# EAGLE design Gripper Control Board (EAGLE 9.5.2)
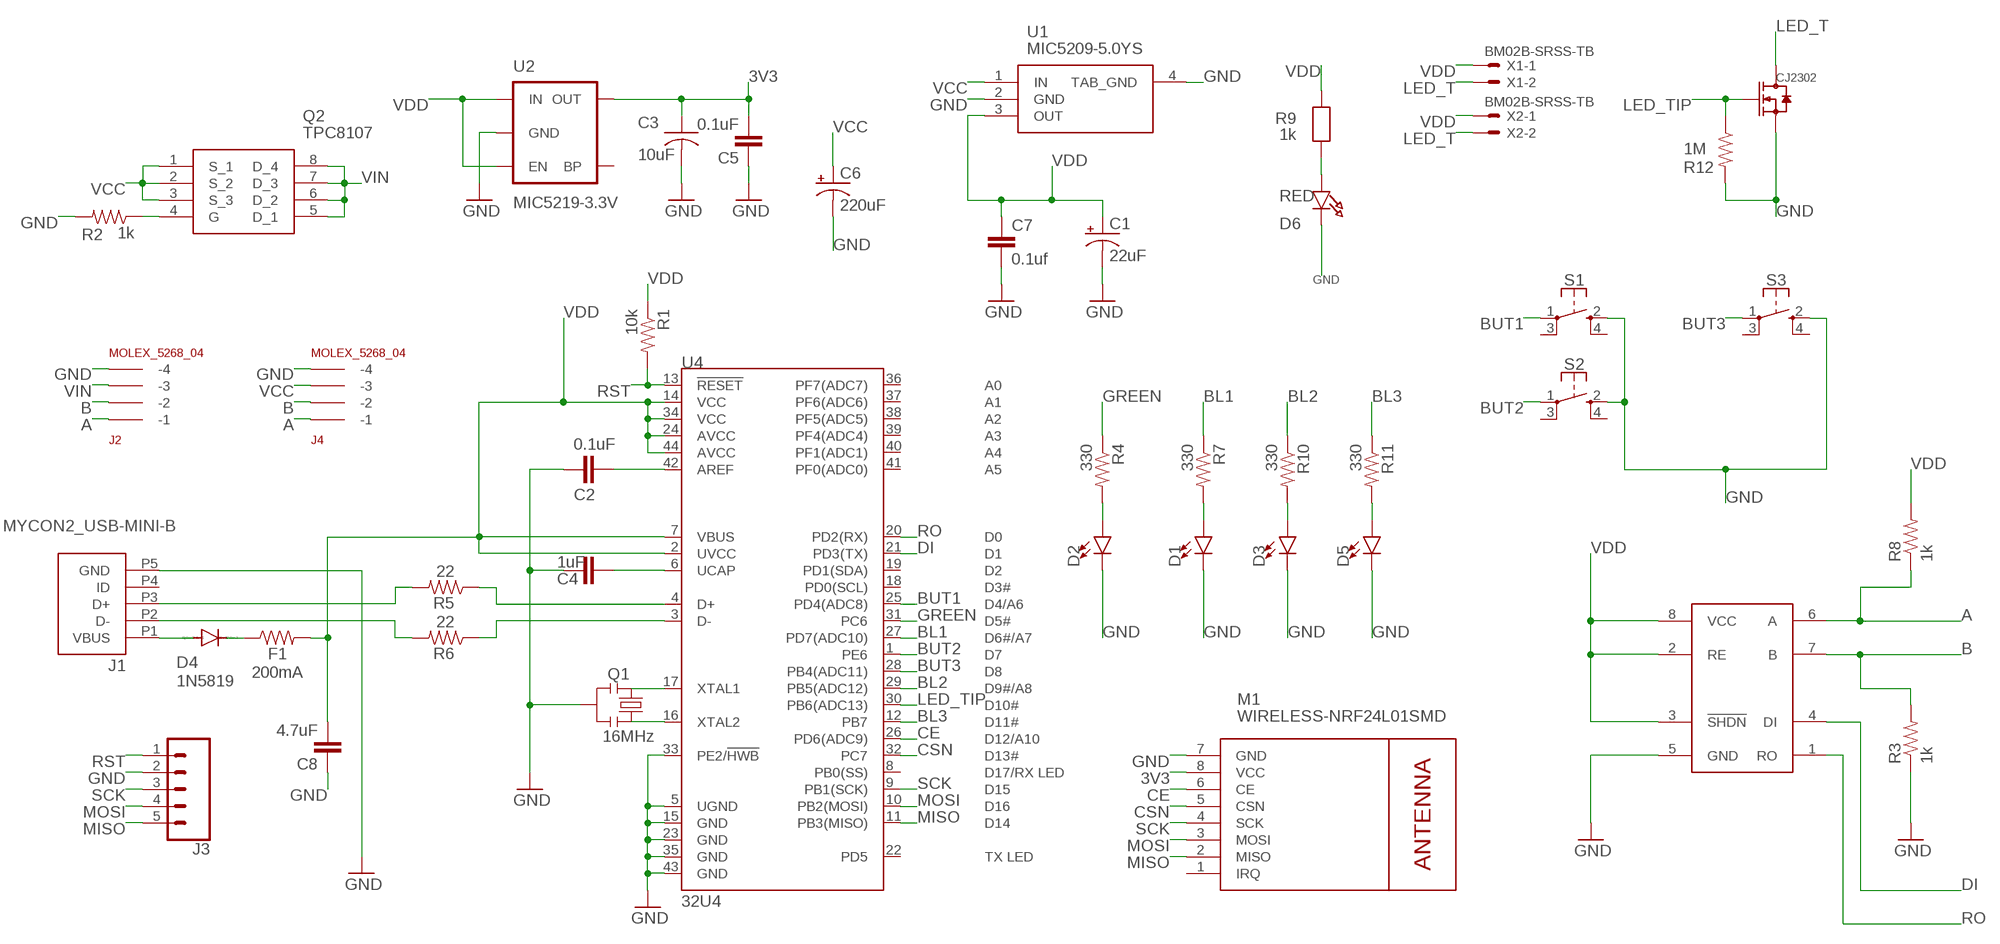
[diagram p0: schematic, sheet 1]

## Parts
C1  22uF  10UF-POLAR-EIA3216-16V-10%(TANT)  [EIA3216]
C2  0.1uF  CAP0603-CAP  [0603-CAP]
C3  10uF  C-USC0805  [C0805]
C4  1uF  CAP0603-CAP  [0603-CAP]
C5  0.1uF  CAP0603-CAP  [0603-CAP]
C6  220uF  100UF-POLAR-25V-20%(ELEC)  [PANASONIC_D]
C7  0.1uf  CAP0603-CAP  [0603-CAP]
C8  4.7uF  CAP0603-CAP  [0603-CAP]
D1  LED0603  [LED-0603]
D2  LED0603  [LED-0603]
D3  LED0603  [LED-0603]
D4  1N5819  DIODE-SOD323-W  [SOD323-W]
D5  LED0603  [LED-0603]
D6  RED  LED0603  [CHIPLED_0603]
F1  200mA  0.22OHM-0805-1/4W-1%  [0805]
J1  MYCON2_USB-MINI-B  [CON2_USB_MICRO_B_AT]
J2  MOLEX_5268_04  [5267-4]
J3  CONN_05SMD2  [1X05_1MM_RA]
J4  MOLEX_5268_04  [5267-4]
M1  WIRELESS-NRF24L01SMD  [WIRELESS-NRF24L01-SMD]
Q1  16MHz  RESONATORSMD  [RESONATOR-SMD]
Q2  TPC8107  [SOIC127P600X175-8N]
Q3  CJ2302  SMD-MOSFET-N-CH-20V-2.1A-CJ2302(SOT-23)  [SOT-23]
R1  10k  RESISTOR0603  [0603-RES]
R2  1k  1KOHM-0603-1/10W-1%  [0603]
R3  1k  RESISTOR0603-RES  [0603-RES]
R4  330  RESISTOR0603  [0603-RES]
R5  22  RESISTOR0603  [0603-RES]
R6  22  RESISTOR0603  [0603-RES]
R7  330  RESISTOR0603  [0603-RES]
R8  1k  RESISTOR0603-RES  [0603-RES]
R9  1k  RESISTOR0603MINI  [0603-MINI]
R10  330  RESISTOR0603  [0603-RES]
R11  330  RESISTOR0603  [0603-RES]
R12  1M  RESISTOR0603  [0603-RES]
S1  SKSGAAE010  [SKSG]
S2  SKSGAAE010  [SKSG]
S3  SKSGAAE010  [SKSG]
U1  MIC5209-5.0YS  [SOT230P700X180-4N]
U2  MIC5219-3.3V  V_REG_LDOSMD  [SOT23-5]
U3  MAX13487  MAX13487SOIC  [MAX13487]
U4  32U4  ATMEGA32U4QFN2  [QFN-44-NOPAD]
X1  BM02B-SRSS-TB  [BM02B-SRSS-TB]
X2  BM02B-SRSS-TB  [BM02B-SRSS-TB]

## Nets
3V3: C3.1 C5.2 M1.8(VCC) U2.5(OUT)
A: J2.P$1(-1) J4.P$1(-1) R8.1 U3.6(A)
B: J2.P$2(-2) J4.P$2(-2) R3.2 U3.7(B)
BL1: R7.1 U4.27(PD7(ADC10))
BL2: R10.1 U4.29(PB5(ADC12))
BL3: R11.1 U4.12(PB7)
BUT1: S1.1 U4.25(PD4(ADC8))
BUT2: S2.1 U4.1(PE6)
BUT3: S3.1 U4.28(PB4(ADC11))
CE: M1.6(CE) U4.26(PD6(ADC9))
CSN: M1.5(CSN) U4.32(PC7)
DI: U3.4(DI) U4.21(PD3(TX))
GND: C1.- C2.1 C3.2 C4.1 C5.1 C6.- C7.2 C8.1 D1.C D2.C D3.C D5.C D6.C J1.P5(GND) J2.P$4(-4) J3.2 J4.P$4(-4) M1.7(GND) Q1.2 Q3.2(S) R2.2 R3.1 R12.2 S1.2 S2.2 S3.2 U1.2(GND) U1.4(TAB_GND) U2.2(GND) U3.5(GND) U4.5(UGND) U4.15(GND) U4.23(GND) U4.33(PE2/!HWB) U4.35(GND) U4.43(GND)
GREEN: R4.1 U4.31(PC6)
LED_T: Q3.3(D) X1.2 X2.2
LED_TIP: Q3.1(G) R12.1 U4.30(PB6(ADC13))
MISO: J3.5 M1.2(MISO) U4.11(PB3(MISO))
MOSI: J3.4 M1.3(MOSI) U4.10(PB2(MOSI))
N$1: D2.A R4.2
N$2: D1.A R7.2
N$3: D3.A R10.2
N$4: D5.A R11.2
N$6: D6.A R9.1
N$7: Q2.4(G) R2.1
N$14: D4.A J1.P1(VBUS)
N$18: D4.C F1.1
N$36: R5.1 U4.4(D+)
N$37: C4.2 U4.6(UCAP)
N$38: R6.1 U4.3(D-)
N$39: C2.2 U4.42(AREF)
N$40: J1.P3(D+) R5.2
N$41: J1.P2(D-) R6.2
RO: U3.1(RO) U4.20(PD2(RX))
RST: J3.1 R1.2 U4.13(!RESET)
SCK: J3.3 M1.4(SCK) U4.9(PB1(SCK))
VCC [POWER]: C6.+ J4.P$3(-3) Q2.1(S_1) Q2.2(S_2) Q2.3(S_3) U1.1(IN)
VDD: C1.+ C7.1 C8.2 F1.2 R1.1 R8.2 R9.2 U1.3(OUT) U2.1(IN) U2.3(EN) U3.2(RE) U3.3(!SHDN) U3.8(VCC) U4.2(UVCC) U4.7(VBUS) U4.14(VCC) U4.24(AVCC) U4.34(VCC) U4.44(AVCC) X1.1 X2.1
VIN [POWER]: J2.P$3(-3) Q2.5(D_1) Q2.6(D_2) Q2.7(D_3) Q2.8(D_4)
X1: Q1.1 U4.17(XTAL1)
X2: Q1.3 U4.16(XTAL2)
Unconnected: J1.P4(ID) M1.1(IRQ) S1.3 S1.4 S2.3 S2.4 S3.3 S3.4 U2.4(BP) U4.8(PB0(SS)) U4.18(PD0(SCL)) U4.19(PD1(SDA)) U4.22(PD5) U4.36(PF7(ADC7)) U4.37(PF6(ADC6)) U4.38(PF5(ADC5)) U4.39(PF4(ADC4)) U4.40(PF1(ADC1)) U4.41(PF0(ADC0))

## Library data of the parts
C1 = SparkFun-Capacitors:10UF-POLAR: 10.0µF polarized capacitors A capacitor is a passive two-terminal electrical component used to store electrical energy temporarily in an electric field.; PROD_ID: CAP-00811; VALUE: 10uF
C2 C4 C5 C8 = SparkFun-Passives:CAP: Capacitor Standard 0603 ceramic capacitor, and 0.1" leaded capacitor.; PROD_ID: CAP-00868
C3 = resistor:C-US: CAPACITOR, American symbol
C6 = SparkFun-Capacitors:100UF-POLAR: 100µF polarized capacitors A capacitor is a passive two-terminal electrical component used to store electrical energy temporarily in an electric field.; PROD_ID: CAP-12547; VALUE: 100uF
C7 = SparkFun-Passives:CAP: Capacitor Standard 0603 ceramic capacitor, and 0.1" leaded capacitor.
D1-D3 D5 = SparkFun-LED:LED: LED (Generic) Standard schematic elements and footprints for 5mm, 3mm, 1206, and 0603 sized LEDs. Generic LEDs with no color specified.
D4 = diode:DIODE-: DIODE
D6 = microbuilder:LED: LED 0603 - 0603 Surface Mount Package 2mA: Green LED - Low Power (3.9mcd, 2ma, 1.7Vf) - Digikey: 475-2709-2-ND Orange LED - Low Power (9.8mcd, 2ma, 1.8Vf) - Digikey: 475-1194-2-ND Red LED - Low Power (5mcd, 2ma, 1.8Vf) - Digikey: 475-1195-2-ND Yellow LED - Low Power (7mcd, 2ma, 1.8Vf) - Digikey: 475-1196-2-ND 5mA: Blue LED - Low Power (17mcd, 5ma, 2.9Vf) - Digikey: LNJ937W8CRACT-ND 0805 - 0805 Surface Mount Package 2mA: Red LED (8.8mcd, 2mA, 1.8Vf, Clear) - Low Power [Digikey: 475-2510-1-ND] Green LED (5mcd, 2mA, 1.8Vf, Clear) - Low Power [Digikey: 475-2730-1-ND] Yellow LED (11.3mcd, 2mA, 1.8Vf, Clear) - Low Power [Digikey: 475-2555-1-ND] 20mA: Red LED (104mcd, 20mA, Diffused) - LS R976 [Digikey: 475-1278-6-ND] Red LED (12mcd, 20mA, 2.0Vf, Clear) - APT2012EC [Digikey: 754-1128-1-ND] Green LED (15mcd, 20mA, 2.2Vf, Clear) - APT2012GC [Digikey: 754-1131-1-ND] Orange LED (160mcd, 20mA, 2.1Vf, Clear) - APT2012SECK [Digikey: 754-1130-1-ND] 1206 - 1206 Surface Mount Package Green LED (26mcd, 20mA, Diffused) - LG N971 [Digikey: 475-1407-6-ND] Red LED (15mcd, 20mA, Diffused) - LH N974 [Digikey: 475-1416-6-ND]
F1 = SparkFun-Resistors:0.22OHM: 0.22Ω resistor A resistor is a passive two-terminal electrical component that implements electrical resistance as a circuit element. Resistors act to reduce current flow, and, at the same time, act to lower voltage levels within circuits. - Wikipedia; PROD_ID: RES-09883; VALUE: 0.22
J1 = SmartPrj:MYCON2_USB-MINI-B
J2 J4 = customCON:MOLEX_5268_04
J3 = SparkFun-Connectors:CONN_05: Multi connection point. Often used as Generic Header-pin footprint for 0.1 inch spaced/style header connections On any of the 0.1 inch spaced packages, you can populate with these: Break Away Headers - Straight <https://www.sparkfun.com/products/116> (PRT-00116) Break Away Male Headers - Right Angle <https://www.sparkfun.com/products/553> (PRT-00553) Female Headers <https://www.sparkfun.com/products/115> (PRT-00115) Break Away Headers - Machine Pin <https://www.sparkfun.com/products/117> (PRT-00117) Break Away Female Headers - Swiss Machine Pin <https://www.sparkfun.com/products/743> (PRT-00743) For SCREWTERMINALS and SPRING TERMINALS visit here: Screw Terimnals on SparkFun.com <https://www.sparkfun.com/search/results?term=Screw+Terminals> (5mm/3.5mm/2.54mm spacing) This device is also useful as a general connection point to wire up your design to another part of your project. Our various solder wires solder well into these plated through hole pads. Hook-Up Wire - Assortment (Stranded, 22 AWG) <https://www.sparkfun.com/products/11375> (PRT-11375) Hook-Up Wire - Assortment (Solid Core, 22 AWG) <https://www.sparkfun.com/products/11367> (PRT-11367) View the entire wire category on our website here <https://www.sparkfun.com/categories/141> Special notes: Molex polarized connector foot print use with SKU : PRT-08231 with associated crimp pins and housings. 1MM SMD Version SKU: PRT-10208
M1 = 1459411900832-nrf24l01plus:WIRELESS-NRF24L01: 2.4 GHz Wireless Module based on NRF24L01 chip
Q1 = Testing:RESONATOR: Resonator Small SMD resonator. This is the itty bitty 10/20MHz resonators with built in caps. CSTCE10M0G55 and CSTCE20M0V53. Footprint for SMD has been used in SFE production for years, and does work okay. 1:1 is an attempt to get larger fillets on the sides so it will be easier to inspect these solders in our AOI machine. The pads have been minimized to match the actual metal under the resonator. To see this relation, it includes an image import of the bottom side of the component. Imported to scale on layer 200.
Q2 = TPC8107:TPC8107: MOSFET P-Channel 30V 12A 8-Pin SOIC TPC8107; ALLIED_NUMBER: 70438040; ALLIED_PRICE-STOCK: https://www.alliedelec.com/diodes-inc-dmg4413lss-13/70438040/; DESCRIPTION: MOSFET P-Channel 30V 12A SOIC8PEP Diodes Inc DMG4413LSS-13 P-channel MOSFET Transistor, 12 A, 30 V, 8-Pin SOIC; HEIGHT: 1.75mm; MANUFACTURER_NAME: Diodes Inc.; MANUFACTURER_PART_NUMBER: DMG4413LSS-13; MOUSER_PART_NUMBER: 621-DMG4413LSS-13; MOUSER_PRICE-STOCK: https://www.mouser.com/Search/Refine.aspx?Keyword=621-DMG4413LSS-13; RS_PART_NUMBER: 7514102P; RS_PRICE-STOCK: http://uk.rs-online.com/web/p/products/7514102P
Q3 = Seeed-Transistor:SMD-MOSFET-N-CH-20V-2.1A-CJ2302(SOT-23): 305030015; MPN: CJ2302
R1 R4 R6 R10 R11 = SparkFun-Resistors:RESISTOR: Resistor Basic schematic elements and footprints for 0603, 1206, and PTH resistors.; PROD_ID: RES-08698
R2 = SparkFun-Resistors:1KOHM: 1kΩ resistor A resistor is a passive two-terminal electrical component that implements electrical resistance as a circuit element. Resistors act to reduce current flow, and, at the same time, act to lower voltage levels within circuits. - Wikipedia; PROD_ID: RES-07856
R3 R8 = SparkFun-Passives:RESISTOR: Resistor Basic schematic elements and footprints for 0603, 1206, and PTH resistors.
R5 R7 R12 = SparkFun-Resistors:RESISTOR: Resistor Basic schematic elements and footprints for 0603, 1206, and PTH resistors.; PROD_ID: RES-08698; SPICEPREFIX: R
R9 = microbuilder:RESISTOR: Resistors 0402 - 0402 Surface Mount Package 22 Ohm 1% 1/16W [Digikey: 311-22.0LRTR-ND] 33 Ohm 5% 1/16W 1.0K 5% 1/16W 1.5K 5% 1/16W 2.0K 1% 1/16W 10.0K 1% 1/16W [Digikey: 311-10.0KLRTR-ND] 10.0K 5% 1/16W [Digikey: RMCF0402JT10K0TR-ND] 12.1K 1% 1/16W [Digikey: 311-22.0LRTR-ND] 100.0K 5% 1/16W 0603 - 0603 Surface Mount Package 0 Ohm 1/10 Watt 1% Resistor 15 Ohm 1/10 Watt 1% Resistor 33 Ohm 1/10 Watt 1% Resistor 49.9 Ohm 1/10 Watt 1% Resistor 100 Ohm 1/10 Watt 1% Resistor 150 Ohm 1/10 Watt 1% Resistor 240 Ohm 1/10 Watt 1% Resistor 390 Ohm 1/10 Watt 1% Resistor 560 Ohm 1/10 Watt 1% Resistor 680 Ohm 1/10 Watt 1% Resistor 750 Ohm 1/10 Watt 1% Resistor 1.0K Ohm 1/10 Watt 1% Resistor 1.5K Ohm 1/10 Watt 1% Resistor 2.0K Ohm 1/10 Watt 1% Resistor 2.2K Ohm 1/10 Watt 1% Resistor 3.3K Ohm 1/10 Watt 1% Resistor 4.7K Ohm 1/10 Watt 1% Resistor 10.0K Ohm 1/10 Watt 1% Resistor 12.0K Ohm 1/10 Watt 1% Resistor 12.1K Ohm 1/10 Watt 1% Resistor 20.0K Ohm 1/10 Watt 1% Resistor 33.0K Ohm 1/10 Watt 1% Resistor 100.0K Ohm 1/10 Watt 1% Resistor 0805 - 0805 Surface Mount Package 0 Ohm 1/8 Watt 1% Resistor 33 Ohm 1/8 Watt 1% Resistor 100 Ohm 1/8 Watt 1% Resistor 150 Ohm 1/8 Watt 1% Resistor 200 Ohm 1/8 Watt 1% Resistor 240 Ohm 1/8 Watt 1% Resistor 330 Ohm 1/8 Watt 1% Resistor 390 Ohm 1/8 Watt 1% Resistor 470 Ohm 1/8 Watt 1% Resistor 1.0K Ohm 1/8 Watt 1% Resistor 1.5K Ohm 1/8 Watt 1% Resistor 2.0K Ohm 1/8 Watt 1% Resistor 4.7K Ohm 1/8 Watt 1% Resistor 5.1K Ohm 1/8 Watt 1% Resistor 5.6K Ohm 1/8 Watt 1% Resistor 10.0K Ohm 1/8 Watt 1% Resistor 22.0K Ohm 1/8 Watt 1% Resistor 33.0K Ohm 1/8 Watt 1% Resistor 100K Ohm 1/8 Watt 1% Resistor 1206 - 1206 Surface Mount Package 2012 - 2010 Surface Mount Package 0.11 Ohm 1/2 Watt 1% Resistor - Digikey: RHM.11UCT-ND
S1-S3 = SKSGAAE010:SKSGAAE010: Black Button Tactile Switch, SPST-NO 50 mA 0.4mm Surface Mount Source: Datasheet <http://uk.rs-online.com/web/p/products/9173829>; DESCRIPTION: Black Button Tactile Switch, SPST-NO 50 mA 0.4mm Surface Mount; HEIGHT: mm; MANUFACTURER_NAME: ALPS; MANUFACTURER_PART_NUMBER: SKSGAAE010; MOUSER_PART_NUMBER: 688-SKSGAAE010; MOUSER_PRICE-STOCK: https://www.mouser.com/Search/Refine.aspx?Keyword=688-SKSGAAE010
U1 = MIC5209-5.0YS:MIC5209-5.0YS: Micrel Semiconductor MIC5209-5.0YS, Low Noise LDO Voltage Regulator, 0.5A, 5 V Source: Datasheet <http://www.micrel.com/_PDF/mic5209.pdf>; DESCRIPTION: Micrel Semiconductor MIC5209-5.0YS, Low Noise LDO Voltage Regulator, 0.5A, 5 V; HEIGHT: 1.8mm; MANUFACTURER_NAME: Microchip; MANUFACTURER_PART_NUMBER: MIC5209-5.0YS; MOUSER_PART_NUMBER: 998-MIC5209-5.0YS; MOUSER_PRICE-STOCK: https://www.mouser.com/Search/Refine.aspx?Keyword=998-MIC5209-5.0YS; RS_PART_NUMBER: 0453340P; RS_PRICE-STOCK: http://uk.rs-online.com/web/p/products/0453340P
U2 = SparkFun:V_REG_LDO: Voltage Regulator LDO Standard 150mA LDO voltage regulator in SOT-23 layout. Micrel part MIC5205. BP (by-pass) pin is used to lower output noise with 470pF cap.
U3 = AET:MAX13487
U4 = SparkFun-IC-Microcontroller:ATMEGA32U4: Atmel MCU, 32KByte Atmel 44-pin 8-bit Microcontroller with 32KBytes of ISP Flash and USB Controller Datasheet <http://cdn.sparkfun.com/datasheets/Dev/Arduino/Boards/ATMega32U4.pdf> SparkFun Products LilyPad Arduino USB - ATmega32U4 Board <https://www.sparkfun.com/products/12049> (DEV-12049) Pro Micro - 5V/16MHz <https://www.sparkfun.com/products/12640> (DEV-12640) Pro Micro - 3.3V/8MHz <https://www.sparkfun.com/products/12587> (DEV-12587) Fio v3 - ATmega32U4 <https://www.sparkfun.com/products/11520> (DEV-11520) Qduino Mini <https://www.sparkfun.com/products/13614> (DEV-13614) Makey Makey - Standard Kit <https://www.sparkfun.com/products/11511> (WIG-11511) Makey Makey Deluxe Kit <https://www.sparkfun.com/products/11519> (WIG-11519); PROD_ID: IC-10828
X1 X2 = con-jst2:?M02B-SRSS-TB: Disconnectable Crimp style connector, 1.0mm pitch 2 contacts

## Net classes
0 SIG: width 0.152 mm, drill 0.3 mm, clearance 0.127 mm
1 POWER: width 0.914 mm, drill 0.3 mm, clearance 0.127 mm

## Board
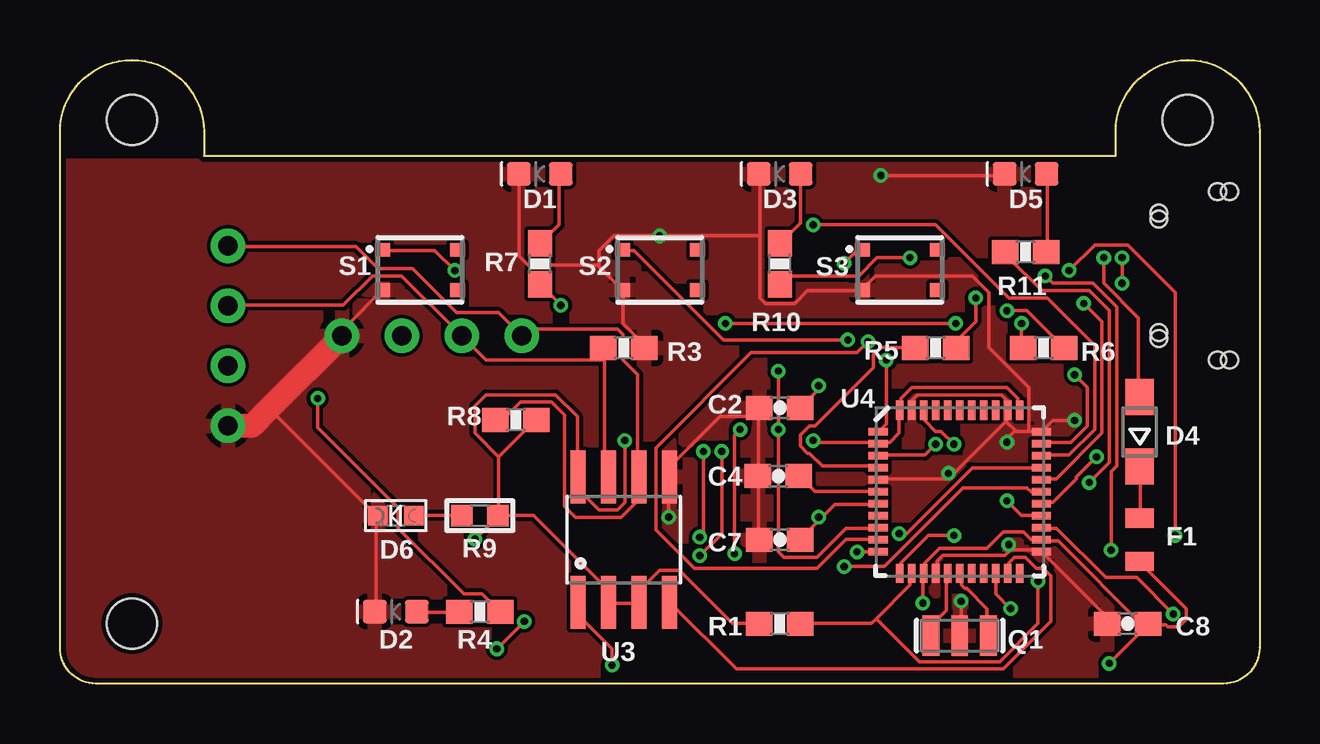
[diagram p1: board, top side]
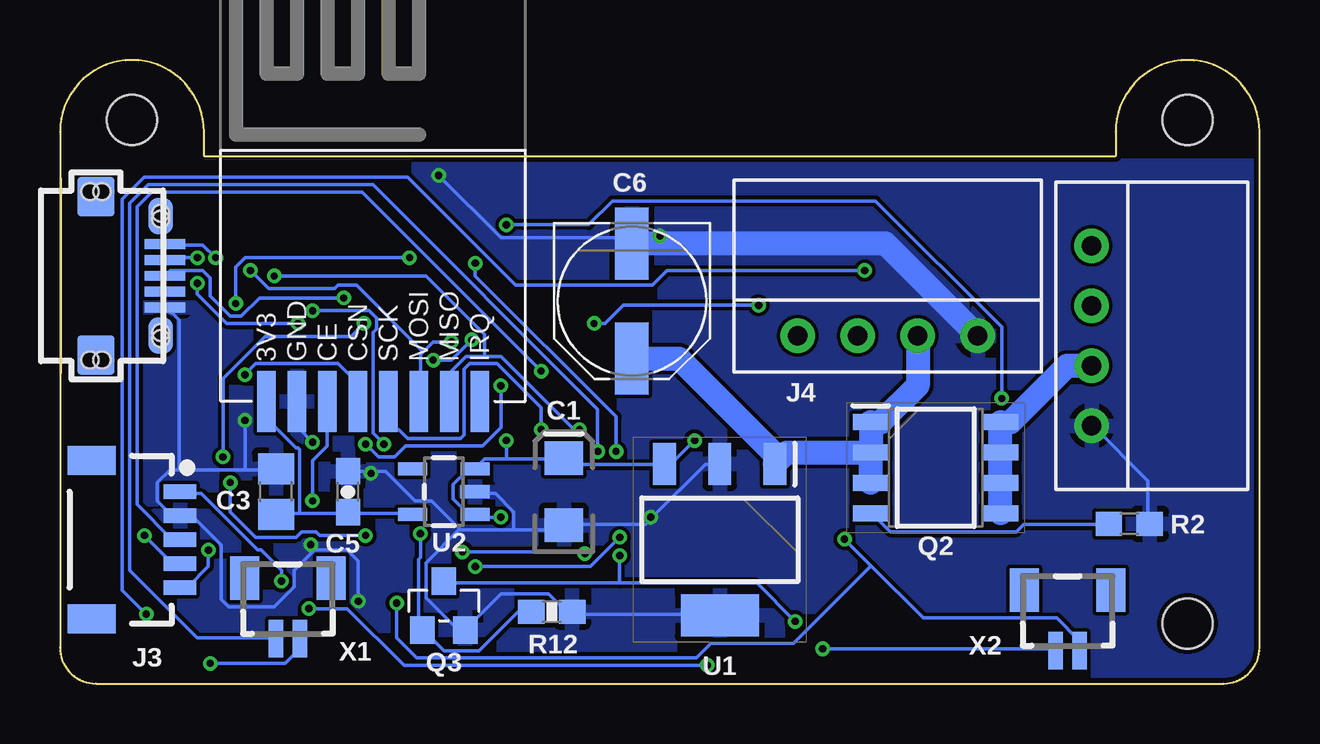
[diagram p2: board, bottom side, seen from below]

Size 50 x 26 mm. Coordinates in mm from the lower left corner, seen from the top.
Outline: 50,23 50,1.5 arc-90 48.5,0 1.5,0 arc-90 0,1.5 0,23 arc-90 3,26 arc-90 6,23 6,22 44,22 44,23 arc-90 47,26 arc-90 50,23
Copper layers (1*16): Top 0.035mm / dielectric 0.95mm / Bottom 0.035mm
Design rules "default *": minimum track width 6mil, minimum drill 0.3mm, track to track 6mil, track to pad 6mil, pad to pad 6mil, via to via 6mil, smd to smd 0mil, copper to edge 8mil, drill to drill 10mil, minimum pad ring 6mil, minimum via ring 6mil, stop-mask expansion 4mil, vias tented up to drill 0.3mm, thermal gap 10mil
Holes 2.1 mm at 3,23.5 47,23.5 3,2.5

### Footprints (pad centres in the part's own frame; a part is rotated, then mirrored left to right if it is on the bottom)
EIA3216 = smd 1.4 x 1.6: + 1.4,0; - -1.4,0
0603-CAP = smd 1.1 x 1: 1 -0.85,0; 2 0.85,0
C0805 = smd 1.3 x 1.5: 1 -0.95,0; 2 0.95,0
PANASONIC_D = smd 3 x 1.4: + 2.4,0; - -2.4,0
LED-0603 = smd 1 x 1: A -0.877,0; C 0.877,0
SOD323-W = smd 1.5 x 1.2: A 1.45,0; C -1.45,0
CHIPLED_0603 = smd 0.8 x 0.8: A 0,-0.75; C 0,0.75
0805 = smd 0.8 x 1.2: 1 -0.9,0; 2 0.9,0
CON2_USB_MICRO_B_AT = smd 0.406 x 1.727: P1 -1.321,2.87; P2 -0.66,2.87; P3 0,2.87; P4 0.66,2.87; P5 1.321,2.87 | smd 1.651 x 1.549: S1 -3.302,0; S2 3.302,0 | smd 1.524 x 1.016: S3 -2.489,2.692; S4 2.489,2.692 | hole 0.7: -3.505,0.254; -3.505,-0.254; 3.505,0.254; 3.505,-0.254; -2.616,2.692; -2.362,2.692; 2.362,2.692; 2.616,2.692
5267-4 = drill 0.8 pad 1.422: P$1 -3.75,-2.5; P$2 -1.25,-2.5; P$3 1.25,-2.5; P$4 3.75,-2.5
1X05_1MM_RA = smd 0.6 x 1.35: 1 -2,0; 2 -1,0; 3 0,0; 4 1,0; 5 2,0 | smd 1.2 x 2: NC1 3.3,-3.675; NC2 -3.3,-3.675
WIRELESS-NRF24L01-SMD = smd 2.54 x 0.762: 1 1.27,0; 2 1.27,1.27; 3 1.27,2.54; 4 1.27,3.81; 5 1.27,5.08; 6 1.27,6.35; 7 1.27,7.62; 8 1.27,8.89
RESONATOR-SMD = smd 0.7 x 1.7: 1 -1.2,0; 2 0,0; 3 1.2,0
SOIC127P600X175-8N = smd 1.5 x 0.65: 1 -2.7,1.905; 2 -2.7,0.635; 3 -2.7,-0.635; 4 -2.7,-1.905; 5 2.7,-1.905; 6 2.7,-0.635; 7 2.7,0.635; 8 2.7,1.905
SOT-23 = smd 1.016 x 1.143: 1 -0.889,-1.016; 2 0.889,-1.016; 3 0,1.016
0603-RES = smd 1.1 x 1: 1 -0.85,0; 2 0.85,0
0603 = smd 1.1 x 1: 1 -0.85,0; 2 0.85,0
0603-MINI = smd 0.9 x 0.9: 1 -0.75,0; 2 0.75,0
SKSG = smd 0.625 x 0.575: 1 -1.562,0.838; 2 -1.562,-0.838; 3 1.562,0.838; 4 1.562,-0.838
SOT230P700X180-4N = smd 1.75 x 0.95: 1 -3.15,2.3; 2 -3.15,0; 3 -3.15,-2.3 | smd 1.75 x 3.25: 4 3.15,0
SOT23-5 = smd 0.55 x 1.2: 1 -0.95,-1.3; 2 0,-1.3; 3 0.95,-1.3; 4 0.95,1.3; 5 -0.95,1.3
MAX13487 = smd 0.61 x 2.21: 1 -1.905,-2.616; 2 -0.635,-2.616; 3 0.635,-2.616; 4 1.905,-2.616; 5 1.905,2.616; 6 0.635,2.616; 7 -0.635,2.616; 8 -1.905,2.616
QFN-44-NOPAD = smd 0.8 x 0.3: 1 -3.4,2.5; 2 -3.4,2; 3 -3.4,1.5; 4 -3.4,1; 5 -3.4,0.5; 6 -3.4,0; 7 -3.4,-0.5; 8 -3.4,-1; 9 -3.4,-1.5; 10 -3.4,-2; 11 -3.4,-2.5; 23 3.4,-2.5; 24 3.4,-2; 25 3.4,-1.5; 26 3.4,-1; 27 3.4,-0.5; 28 3.4,0; 29 3.4,0.5; 30 3.4,1; 31 3.4,1.5; 32 3.4,2; 33 3.4,2.5 | smd 0.3 x 0.8: 12 -2.5,-3.4; 13 -2,-3.4; 14 -1.5,-3.4; 15 -1,-3.4; 16 -0.5,-3.4; 17 0,-3.4; 18 0.5,-3.4; 19 1,-3.4; 20 1.5,-3.4; 21 2,-3.4; 22 2.5,-3.4; 34 2.5,3.4; 35 2,3.4; 36 1.5,3.4; 37 1,3.4; 38 0.5,3.4; 39 0,3.4; 40 -0.5,3.4; 41 -1,3.4; 42 -1.5,3.4; 43 -2,3.4; 44 -2.5,3.4
BM02B-SRSS-TB = smd 0.6 x 1.55: 1 0.5,-1.625; 2 -0.5,-1.625 | smd 1.2 x 1.8: FIT@1 1.8,0.9; FIT@2 -1.8,0.9

### Placement (x,y rotation side)
C1  29,8 90 bottom
C2  30,11.5 0 top
C3  41,8 90 bottom
C4  29.94,8.65 0 top
C5  38,8 270 bottom
C6  26.16,15.95 270 bottom
C7  30,6 180 top
C8  44.5,2.5 0 top
D1  20,21.25 180 top
D2  14,3 180 top
D3  30,21.25 180 top
D4  45,10.5 90 top
D5  40.25,21.25 180 top
D6  14,7 90 top
F1  45,6 270 top
J1  48.5,17 270 bottom
J2  4.5,14.5 270 bottom
J3  45,6 270 bottom
J4  15.5,17 0 bottom
M1  32.5,10.5 90 bottom
Q1  37.5,2 180 top
Q2  13.5,9 0 bottom
Q3  34,3.25 0 bottom
R1  30,2.5 0 top
R2  5.43,6.66 0 bottom
R3  23.5,14 180 top
R4  17.5,3 180 top
R5  36.5,14 0 top
R6  41,14 180 top
R7  20,17.5 90 top
R8  19,11 0 top
R9  17.5,7 0 top
R10  30,17.5 90 top
R11  40.25,18 0 top
R12  29.5,3 0 bottom
S1  15,17.25 0 top
S2  25,17.25 0 top
S3  35,17.25 0 top
U1  22.5,6 270 bottom
U2  34,8 90 bottom
U3  23.5,6 0 top
U4  37.5,8 0 top
X1  40.5,3.5 0 bottom
X2  8,3 0 bottom

### Tracks (layer width: path | path; a pad name or v marks a point on that pad's centre or on a via)
3V3
  Bottom 0.152: U2.5 35.36,7.09 37.95,7.09 C5.2 38.02,7.09 40.01,7.09 | 40.01,7.09 41,7.09 C3.1 | 40.01,7.09 40.01,9.75 40.08,9.83 40.16,9.83 41.38,11.05 41.38,11.73 M1.8
A
  Top 0.152: R8.1 18.21,11.05 18.52,11.05 19.2,11.73 20.5,11.73 21.03,11.2 21.03,7.39 21.49,6.93 23.39,6.93 24.08,7.62 24.08,8.61 U3.6 24.08,8.69 24.08,12.88 23.47,13.49 23.47,14.55 23.24,14.78 19.51,14.78 19.28,14.55 J4.P$1 19.2,14.55 18.29,15.47 16.54,15.47 14.71,17.3 13.26,17.3 12.34,18.21 7.01,18.21 J2.P$1
B
  Top 0.152: 22.71,13.49 22.71,8.84 22.86,8.69 U3.7 | 22.71,13.49 22.71,13.95 R3.2 | J2.P$2 7.01,15.77 11.81,15.77 13.03,16.99 14.25,16.99 16.69,14.55 J4.P$2 16.76,14.48 17.75,13.49 22.71,13.49
BL1  (via drill 0.3)
  Top 0.152: v43.2,9.45 42.37,8.61 42.37,8.53 41.38,7.54 40.92,7.54 U4.27 | v27.74,15.01 v37.34,15.01 | v20.88,15.77 20.04,16.61 R7.1
  Bottom 0.152: v43.2,9.45 43.2,12.72 41.45,14.48 37.87,14.48 v37.34,15.01 | v27.74,15.01 27.28,15.01 26.52,15.77 v20.88,15.77
BL2  (via drill 0.3)
  Top 0.152: v42.67,15.85 43.43,15.09 43.43,10.44 41.53,8.53 40.92,8.53 U4.29 | v35.43,17.75 34.06,17.75 33.3,16.99 30.33,16.99 30.02,16.69 R10.1
  Bottom 0.152: v42.67,15.85 42.67,17.37 42.29,17.75 v35.43,17.75
BL3  (via drill 0.3)
  Top 0.152: v37.26,6.17 36.2,6.17 35.05,5.03 35.05,4.65 U4.12 | v42.9,8.38 43.74,9.22 43.74,15.54 42.9,16.38 40.92,16.38 39.47,17.83 39.47,17.98 R11.1
  Bottom 0.152: v37.26,6.17 39.17,6.17 39.32,6.33 39.93,6.33 40.16,6.1 41.83,6.1 42.9,7.16 v42.9,8.38
BUT1  (via drill 0.3)
  Top 0.152: v16.46,17.22 15.62,18.06 13.49,18.06 S1.1 | v46.41,2.9 44.88,4.42 43.59,4.42 41.53,6.48 40.92,6.48 U4.25
  Bottom 0.152: v16.46,17.22 24.69,17.22 25.3,16.61 31.01,16.61 35.51,21.11 46.48,21.11 47.4,20.19 47.4,3.89 v46.41,2.9
BUT2  (via drill 0.3)
  Top 0.152: v32.84,14.33 27.66,14.33 23.93,18.06 23.47,18.06 S2.1 | v34.44,13.49 34.44,10.82 34.14,10.52 U4.1
  Bottom 0.152: v32.84,14.33 33.68,13.49 v34.44,13.49
BUT3  (via drill 0.3)
  Top 0.152: v32.69,17.53 33.22,18.06 33.38,18.06 S3.1 | v26.82,9.68 26.82,6.25 v26.67,6.1 | v32.69,4.88 34.37,4.88 37.64,8.15 40.31,8.15 40.46,8 40.84,8 U4.28
  Bottom 0.152: v32.69,17.53 32.69,16.99 26.82,11.12 v26.82,9.68 | v26.67,6.1 27.89,4.88 v32.69,4.88
CE  (via drill 0.3)
  Top 0.152: v39.47,7.62 40.08,7.01 40.84,7.01 U4.26
  Bottom 0.152: v39.47,7.62 39.47,9.3 38.86,9.91 38.86,11.73 M1.6
CSN  (via drill 0.3)
  Top 0.152: v42.29,12.88 42.82,12.34 42.82,10.74 42.14,10.06 40.92,10.06 U4.32
  Bottom 0.152: v42.29,12.88 41.83,13.34 38.41,13.34 37.64,12.57 37.64,11.81 M1.5
DI
  Top 0.152: U4.21 39.55,4.65 39.55,5.03 39.78,5.26 40.23,5.26 40.69,4.8 41,4.8 41.3,4.5 41.3,2.59 39.32,0.61 28.19,0.61 25.45,3.35 U3.4
GND  (via drill 0.3)
  Top 0.152: C7.2 29.11,6.02 29.11,8.61 C4.1 29.11,8.69 29.11,11.12 | 29.11,11.12 29.11,11.43 C2.1 29.11,11.12 | 29.11,11.12 27.51,11.12 25.45,9.07 25.45,8.69 U3.5 25.38,8.61 v25.38,6.93 | 39.59,5.52 39.62,5.56 40.84,5.56 U4.23 40.92,5.49 43.59,2.82 43.59,2.52 C8.1 | 39.59,5.52 39.4,5.33 36.8,5.33 36.58,5.11 36.58,4.65 U4.15 | v37.57,3.43 37.57,2.06 Q1.2 | v39.55,5.79 39.55,5.56 39.59,5.52 | 39.43,10.94 39.47,10.97 39.47,11.35 U4.35 39.47,11.43 39.47,11.81 39.24,12.04 35.74,12.04 35.51,11.81 35.51,11.43 U4.43 | 39.43,10.94 37.15,8.65 | 37.15,8.65 37.03,8.53 34.14,8.53 U4.5 | 40.39,10.52 39.85,10.52 39.81,10.55 | 40.39,10.52 40.84,10.52 U4.33 40.92,10.52 41.38,10.97 v42.29,10.97 | 39.43,10.94 39.81,10.55 | v39.47,10.06 39.47,10.21 39.81,10.55 | 29.18,18.67 29.18,21.18 D3.C | 29.18,18.67 29.18,16.08 29.41,15.85 30.63,15.85 31.17,16.38 33.38,16.38 S3.2 33.45,16.46 33.98,16.99 38.02,16.99 38.71,16.31 38.71,14.02 40.39,12.34 40.39,10.52 | R3.1 24.31,14.02 24.31,14.17 23.47,15.01 23.47,16.38 S2.2 23.39,16.46 22.44,17.41 | 22.44,17.41 22.4,17.45 19.51,17.45 19.13,17.83 19.13,21.18 D1.C | 29.18,18.67 v24.99,18.67 23.09,18.67 22.48,18.06 22.48,17.45 22.44,17.41 | 37.15,8.65 v37.03,8.76 | D2.C 13.18,3.05 13.18,6.93 D6.C 13.18,7.01 8.72,11.47 | S1.2 13.41,16.38 11.96,14.94 J4.P$4 | v34.21,21.18 39.32,21.18 D5.C
  Top 1: J4.P$4 8.72,11.47 8,10.75 J2.P$4
  Bottom 0.152: 37.03,8.84 36.42,8.84 35.2,7.62 34.52,7.62 33.34,6.44 | 37.03,8.84 37.95,8.84 C5.1 | 33.34,6.44 33.3,6.4 31.09,6.4 | 31.09,6.4 29.18,6.4 29.03,6.55 C1.- 28.96,6.63 25.6,6.63 25.34,6.9 | 31.09,6.4 31.09,7.16 31.85,7.92 32.69,7.92 U2.2 | 25.34,6.9 23.09,9.14 22.55,9.14 U1.2 | 33.34,6.44 34.75,5.03 34.75,3.58 33.45,2.29 33.15,2.29 Q3.2 33.07,2.29 31.62,3.73 29.64,3.73 28.96,3.05 28.65,3.05 R12.2 28.57,2.97 28.5,2.9 22.55,2.9 U1.4 | v25.38,6.93 25.34,6.9 | 42.29,8.91 41.07,8.91 C3.2 | 42.29,8.91 45.03,8.91 | 45.03,8.91 45.41,8.91 45.95,8.38 45.95,7.62 45.34,7.01 45.03,7.01 J3.2 44.96,6.93 44.42,6.93 43.28,5.79 43.28,3.5 42.98,3.2 41.07,3.2 40.23,4.04 40.23,4.72 39.51,5.45 | v37.57,3.43 37.57,5.11 38.02,5.56 39.4,5.56 39.51,5.45 | 45.03,8.91 45.03,15.16 45.34,15.47 45.41,15.47 45.57,15.62 J1.P5 | v39.55,5.79 39.55,5.49 39.51,5.45 | v39.47,10.06 40.08,10.67 40.08,11.73 M1.7 | v42.29,10.97 42.29,8.91 | v37.03,8.76 37.03,8.84 | v34.21,21.18 31.62,18.59 26.59,18.59 26.19,18.36 | R2.2 4.65,6.71 4.65,8.46 6.93,10.74 J2.P$4 | v24.99,18.67 24.99,18.34
  Bottom 1: J4.P$4 15.6,18.34 24.99,18.34 C6.- 26.18,18.36 26.19,18.36
  pour Top: -1.27,21.59 52.07,21.59 52.07,-1.27 -1.27,-1.27
  pour Bottom: -2.54,21.59 53.34,21.59 53.34,-2.54 -2.54,-2.54
GREEN  (via drill 0.3)
  Top 0.152: v31.39,19.13 36.5,19.13 39.55,16.08 41.15,16.08 43.13,14.1 43.13,10.59 42.06,9.53 40.92,9.53 U4.31 | v10.74,11.89 10.74,10.67 14.1,7.32 14.1,6.48 16.84,3.73 17.6,3.73 18.29,3.05 R4.1
  Bottom 0.152: v31.39,19.13 27.96,19.13 26.98,20.12 16,20.12 10.74,14.86 v10.74,11.89
LED_T  (via drill 0.3)
  Top 0.152: v18.21,1.45 v19.36,2.59 | v27.58,9.68 27.58,6.25 v26.67,5.33
  Bottom 0.152: 26.67,4.19 20.95,4.19 v19.36,2.59 | 26.67,4.19 33.98,4.19 Q3.3 | v18.21,1.45 8.53,1.45 X2.2 | v27.58,9.68 27.58,11.43 36.96,20.8 46.33,20.8 47.09,20.04 47.09,4.72 44.27,1.91 41.07,1.91 X1.2 | 26.67,4.19 v26.67,5.33
LED_TIP  (via drill 0.3)
  Top 0.152: v34.98,6.25 35.28,6.25 38.02,8.99 40.84,8.99 U4.30
  Bottom 0.152: v34.98,6.25 34.98,5.26 35.05,5.18 35.05,2.44 34.9,2.29 Q3.1 34.82,2.21 33.98,1.37 32.54,1.37 30.94,2.97 30.4,2.97 R12.1
MISO  (via drill 0.3)
  Top 0.152: v33.22,5.49 34.06,5.49 U4.11 | v28.12,5.41 28.12,10.36 v28.35,10.59 | v43.81,5.56 43.81,8.84 44.04,9.07 44.04,15.7 43.05,16.69 41.38,16.69 v41.07,16.99
  Bottom 0.152: v33.22,5.49 28.19,5.49 v28.12,5.41 | v28.35,10.59 28.57,10.59 31.62,13.64 32.31,13.64 | 32.31,13.64 33.07,13.64 33.76,12.95 33.76,11.81 M1.2 | v43.81,5.56 43.81,4.88 44.65,4.04 44.96,4.04 J3.5 | v41.07,16.99 34.75,16.99 32.31,14.55 32.31,13.64
MOSI  (via drill 0.3)
  Top 0.152: v33.68,14.25 33.22,13.79 28.8,13.79 24.84,9.83 24.84,6.4 26.44,4.8 31.55,4.8 32.77,6.02 34.06,6.02 U4.10 | v46.48,6.17 46.48,16.31 44.5,18.29 43.13,18.29 v42.06,17.22
  Bottom 0.152: v33.68,14.25 34.44,14.25 34.86,13.83 | 34.86,13.83 34.98,13.72 34.98,11.81 M1.3 | v46.48,6.17 45.34,5.03 45.03,5.03 J3.4 | v42.06,17.22 41.3,16.46 38.56,16.46 38.41,16.61 37.64,16.61 34.86,13.83
N$1
  Top 0.152: D2.A 14.94,2.97 16.61,2.97 R4.2
N$2
  Top 0.152: D1.A 20.8,21.18 20.8,19.13 20.04,18.36 R7.2
N$3
  Top 0.152: D3.A 30.86,21.18 30.86,19.2 30.02,18.36 R10.2
N$4
  Top 0.152: D5.A 41.15,21.18 41.15,18.06 R11.2
N$6
  Top 0.152: D6.A 14.78,7.01 16.69,7.01 R9.1
N$7
  Bottom 0.152: R2.1 6.33,6.63 9.83,6.63 10.13,6.33 15.39,6.33 16.15,7.09 Q2.4
N$14  (via drill 0.3)
  Top 0.152: v43.51,17.75 43.51,16.69 44.96,15.24 44.96,11.96 D4.A
  Bottom 0.152: v43.51,17.75 44.04,18.29 45.57,18.29 J1.P1
N$18
  Top 0.152: F1.1 45.03,6.93 45.03,8.99 D4.C
N$36
  Top 0.152: U4.4 34.06,9.07 31.77,9.07 31.24,9.6 31.17,9.6 30.86,9.91 30.86,10.36 31.24,10.74 31.47,10.74 33.91,13.18 33.91,13.72 34.21,14.02 35.59,14.02 R5.1
N$37
  Top 0.152: U4.6 34.06,8 31.47,8 30.86,8.61 C4.2
N$38  (via drill 0.3)
  Top 0.152: v36.5,9.98 36.04,9.53 34.14,9.53 U4.3 | v39.47,15.54 40.31,15.54 41.83,14.02 R6.1
  Bottom 0.152: v36.5,9.98 36.96,10.44 36.96,14.63 36.8,14.78 36.8,15.24 37.11,15.54 v39.47,15.54
N$39  (via drill 0.3)
  Top 0.152: v37.26,9.98 36.73,10.52 36.5,10.52 36.04,10.97 36.04,11.35 U4.42 | v31.62,12.42 31.62,12.27 30.86,11.51 C2.2
  Bottom 0.152: v37.26,9.98 36.73,9.45 36.04,9.45 35.59,9.91 32.38,9.91 31.62,10.67 v31.62,12.42
N$40  (via drill 0.3)
  Top 0.152: v38.18,16.08 38.18,15.09 37.41,14.33 37.41,14.02 R5.2
  Bottom 0.152: v38.18,16.08 41.68,16.08 42.44,15.32 42.9,15.32 43.74,16.15 43.74,16.92 44.04,17.22 45.41,17.22 45.57,17.07 J1.P3
N$41  (via drill 0.3)
  Top 0.152: v40.08,15.01 40.08,14.02 R6.2 | v44.27,17.75 v44.27,16.69
  Bottom 0.152: v40.08,15.01 43.05,15.01 44.27,16.23 v44.27,16.69 | v44.27,17.75 45.49,17.75 45.57,17.68 J1.P2
RO  (via drill 0.3)
  Top 0.152: v39.62,3.12 39.01,3.73 39.01,4.57 U4.20 | v23.01,0.76 23.01,1.45 21.64,2.82 21.64,3.35 U3.1
  Bottom 0.152: v39.62,3.12 38.02,3.12 35.66,0.76 v23.01,0.76
RST  (via drill 0.3)
  Top 0.152: 34.02,2.71 33.83,2.52 30.86,2.52 R1.2 | 34.02,2.71 35.43,4.12 35.43,4.57 U4.13 | v40.77,4.27 40.77,2.52 39.17,0.91 35.81,0.91 34.02,2.71
  Bottom 0.152: v40.77,4.27 40.77,4.72 41.6,5.56 41.76,5.56 44.12,7.92 44.96,7.92 J3.1
SCK  (via drill 0.3)
  Top 0.152: U4.9 34.06,6.48 32.77,6.48 31.55,5.26 30.18,5.26 29.95,5.49 v29.95,10.59 v29.95,13.03
  Bottom 0.152: v29.95,10.59 29.95,11.51 31.77,13.34 32.92,13.34 33.15,13.11 33.15,10.36 33.3,10.21 35.51,10.21 36.27,10.97 36.27,11.73 M1.4 | v29.95,13.03 37.41,20.5 46.18,20.5 46.79,19.89 46.79,7.47 45.34,6.02 45.03,6.02 J3.3
VCC
  Bottom 0.914: 20.2,9.55 U1.1 | 15.78,10.9 Q2.1
  Bottom 1: C6.+ 24.2,13.54 20.2,9.55 | J4.P$3 14.25,12.43 15.78,10.9 | U1.1 19.71,9.63 Q2.2 | Q2.1 Q2.2 | Q2.3 Q2.2
VDD  (via drill 0.3)
  Top 0.152: U4.34 39.93,11.43 39.93,11.89 39.47,12.34 35.51,12.34 35.05,11.89 35.05,11.43 U4.44 34.98,11.35 34.98,10.44 34.59,10.06 34.14,10.06 U4.2 34.06,10.06 31.47,10.06 v31.39,10.13 | 31.66,6.82 30.86,6.02 C7.1 | 31.66,6.82 32.31,7.47 34.06,7.47 U4.7 | v31.62,6.93 31.62,6.86 31.66,6.82 | C8.2 45.41,2.44 46.1,2.44 46.18,2.36 46.63,2.36 46.94,2.67 46.94,3.12 45.03,5.03 F1.2 | v43.74,0.84 45.34,2.44 C8.2 | C8.2 45.19,2.36 41.6,5.94 40.92,5.94 U4.24 40.84,6.02 40.46,6.02 40.16,6.33 39.32,6.33 38.63,5.64 36.65,5.64 36.04,5.03 36.04,4.65 U4.14 35.97,4.57 v35.97,3.35 | R1.1 29.11,2.52 28.04,2.52 25.83,4.72 24.99,4.72 24.16,3.89 24.16,3.43 U3.3 24.08,3.35 22.94,3.35 U3.2 22.86,3.43 22.86,3.89 19.74,7.01 18.36,7.01 R9.2 | 18.29,9.45 18.29,7.01 R9.2 | 18.29,9.45 19.81,10.97 R8.2 | v17.3,6.02 18.21,6.93 R9.2 | 18.29,9.45 17.3,10.44 17.3,11.58 17.75,12.04 20.65,12.04 21.57,11.12 21.57,8.69 U3.8 21.64,8.61 21.64,8.08 22.48,7.24 23.24,7.24 23.55,7.54 v23.55,10.13
  Bottom 0.152: 31.39,9.37 32.31,9.37 32.69,8.99 U2.3 32.77,8.91 32.99,8.91 33.6,8.31 33.6,7.7 32.99,7.09 32.77,7.09 U2.1 32.69,7.01 32.61,6.93 v31.62,6.93 | 31.39,9.37 29.03,9.37 C1.+ 28.96,9.37 28.73,9.14 24.84,9.14 U1.3 24.77,9.22 24.46,9.22 v23.55,10.13 | 31.39,9.37 v31.39,10.13 | v43.74,0.84 40.62,0.84 40.01,1.45 40.01,1.83 X1.1 | v17.3,6.02 16.19,4.92 | 16.19,4.92 14.02,2.74 8.46,2.74 7.54,1.83 7.54,1.45 X2.1 | v35.97,3.35 35.97,1.91 35.13,1.07 23.47,1.07 22.86,1.68 19.43,1.68 16.19,4.92
VIN
  Bottom 0.914: 10.38,10.9 Q2.8
  Bottom 1: J2.P$3 8.03,13.25 10.38,10.9 | Q2.8 Q2.7 Q2.6 Q2.5
X1
  Top 0.152: U4.17 37.57,4.57 37.57,4.12 37.72,3.96 37.8,3.96 38.63,3.12 38.63,2.06 Q1.1
X2
  Top 0.152: U4.16 36.96,4.57 36.96,3.05 36.35,2.44 36.35,2.06 Q1.3